# Altium project CATS-FAT.PrjPcb
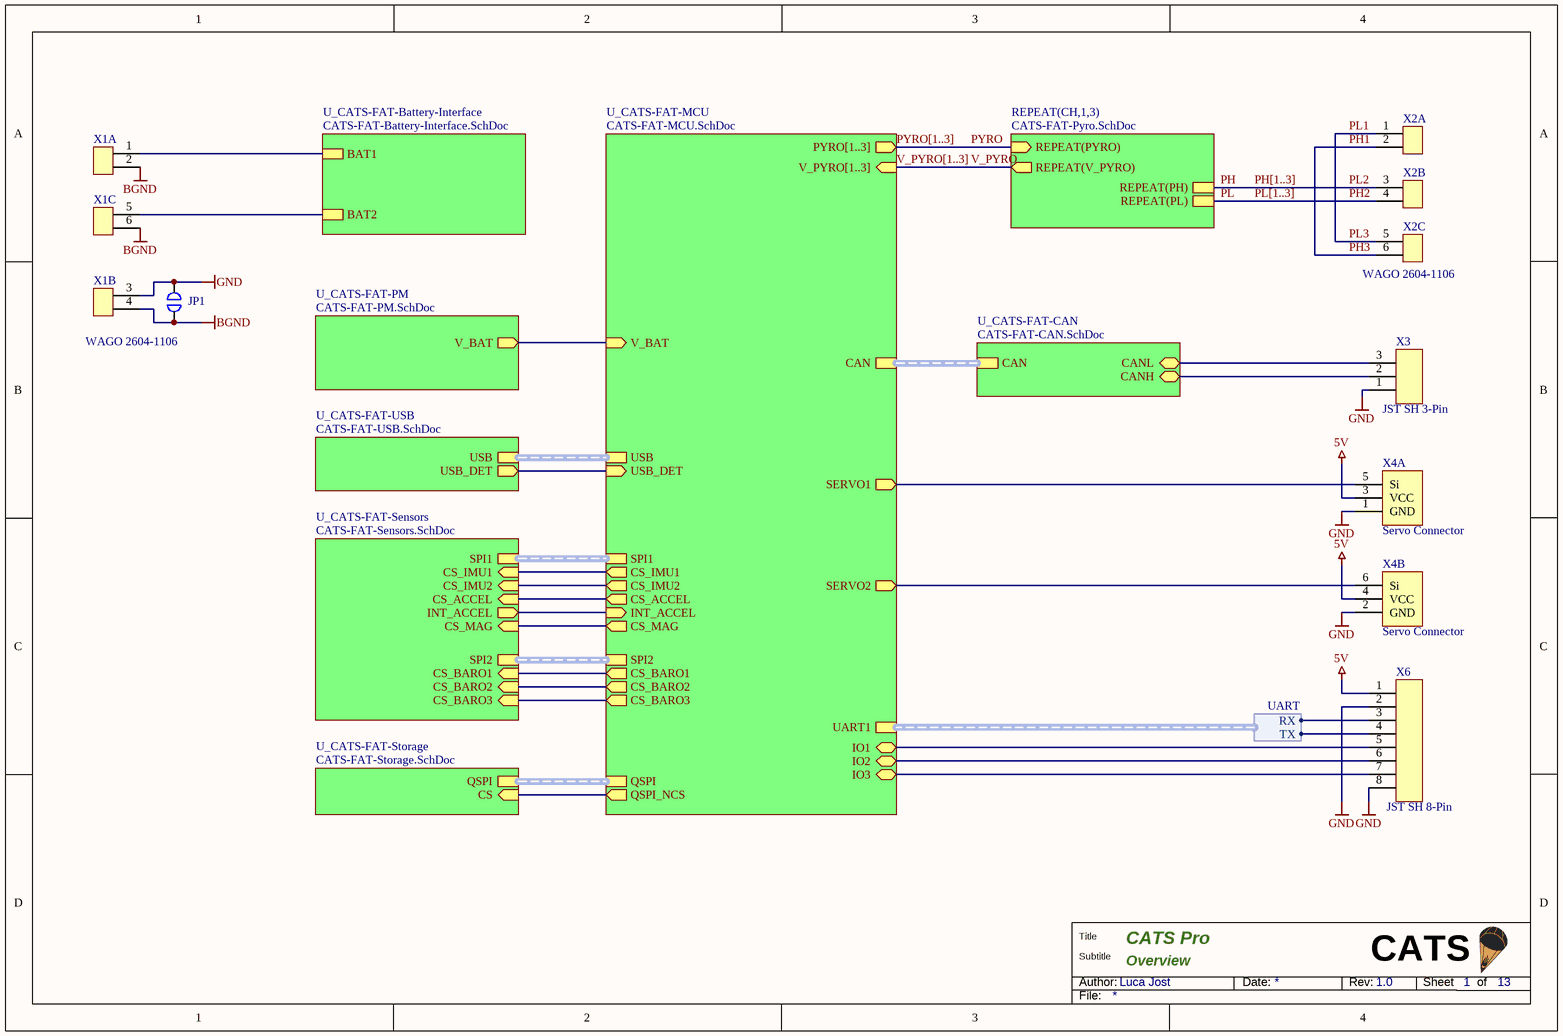
[diagram p0: CATS-FAT-Overview.SchDoc]
6 sheets, 132 parts. Net scope: hierarchical (ports join the sheet entries above them; power ports are global).
Board file: CATS-FAT..PcbDoc
Sheets:
  CATS-FAT-Overview.SchDoc
    U_CATS-FAT-Battery-Interface = CATS-FAT-Battery-Interface.SchDoc
    U_CATS-FAT-CAN = CATS-FAT-CAN.SchDoc
    U_CATS-FAT-PM = CATS-FAT-PM.SchDoc
    CH1 = CATS-FAT-Pyro.SchDoc
    CH2 = CATS-FAT-Pyro.SchDoc
    CH3 = CATS-FAT-Pyro.SchDoc
    U_CATS-FAT-MCU = CATS-FAT-MCU.SchDoc

## Sheet CATS-FAT-Overview.SchDoc: CATS Pro
size A4; Author: Luca Jost; Revision: 1.0; SheetNumber: 1; SheetTotal: 13; Subtitle: Overview

### Parts
JP1  Jumper  [SMD Solder Jumper 1x2mm]  (value not drawn)  (no BOM)
X1  WAGO 2604-1106  [THT PCB Terminal Wago 2604-1106]  (value not drawn)  (parts A,B,C of 3)
X2  WAGO 2604-1106  [THT PCB Terminal Wago 2604-1106]  (value not drawn)  (parts A,B,C of 3)
X3  JST SH 3-Pin  [SMD CONNECTOR JST-SR 3 PIN]
X4  Servo Connector  [THT Stiftleiste 6-Pol (2x3) 90°]  (parts A,B of 2)
X6  JST SH 8-Pin  [SMD CONNECTOR JST-SR 8 PIN]

### Sub-sheets
REPEAT(CH,1,3) = CATS-FAT-Pyro.SchDoc: REPEAT(PYRO) (in), REPEAT(V_PYRO) (out), REPEAT(PH), REPEAT(PL)
U_CATS-FAT-Battery-Interface = CATS-FAT-Battery-Interface.SchDoc: BAT1, BAT2
U_CATS-FAT-CAN = CATS-FAT-CAN.SchDoc: CAN (harness CAN), CANH (bidir), CANL (bidir)
U_CATS-FAT-MCU = CATS-FAT-MCU.SchDoc: SPI1 (harness SPI), SPI2 (harness SPI), CS_IMU1 (out), CS_IMU2 (out), CS_ACCEL (out), INT_ACCEL (in), CS_MAG (out), CS_BARO1 (out), CS_BARO2 (out), CS_BARO3 (out), V_PYRO[1..3] (in), PYRO[1..3] (out), USB_DET (in), QSPI (harness QSPI), QSPI_NCS (out), CAN (harness CAN), V_BAT (in), IO1 (bidir), IO2 (bidir), IO3 (bidir), UART1 (harness UART), SERVO1 (out), SERVO2 (out), USB (harness USB)
U_CATS-FAT-PM = CATS-FAT-PM.SchDoc: V_BAT (out)
U_CATS-FAT-Sensors = CATS-FAT-Sensors.SchDoc (file not in this document): CS_IMU1 (in), CS_IMU2 (in), CS_ACCEL (in), INT_ACCEL (out), CS_BARO1 (in), CS_BARO2 (in), CS_BARO3 (in), SPI1, SPI2, CS_MAG (in)
U_CATS-FAT-Storage = CATS-FAT-Storage.SchDoc (file not in this document): QSPI (harness QSPI), CS (in)
U_CATS-FAT-USB = CATS-FAT-USB.SchDoc (file not in this document): USB (harness USB), USB_DET (out)

### Harnesses
UART: TX, RX

### Nets
5V: X4.3(VCC) X4.4(VCC) X6.1
BGND: JP1.2 X1.2 X1.4 X1.6
GND: JP1.1 X1.3 X3.1 X4.1(GND) X4.2(GND) X6.2 X6.8
CS_ACCEL: sheet U_CATS-FAT-Sensors/CS_ACCEL, sheet U_CATS-FAT-MCU/CS_ACCEL
CS_BARO1: sheet U_CATS-FAT-Sensors/CS_BARO1, sheet U_CATS-FAT-MCU/CS_BARO1
CS_BARO2: sheet U_CATS-FAT-Sensors/CS_BARO2, sheet U_CATS-FAT-MCU/CS_BARO2
CS_BARO3: sheet U_CATS-FAT-Sensors/CS_BARO3, sheet U_CATS-FAT-MCU/CS_BARO3
CS_IMU1: sheet U_CATS-FAT-Sensors/CS_IMU1, sheet U_CATS-FAT-MCU/CS_IMU1
CS_IMU2: sheet U_CATS-FAT-Sensors/CS_IMU2, sheet U_CATS-FAT-MCU/CS_IMU2
CS_MAG: sheet U_CATS-FAT-Sensors/CS_MAG, sheet U_CATS-FAT-MCU/CS_MAG
INT_ACCEL: sheet U_CATS-FAT-Sensors/INT_ACCEL, sheet U_CATS-FAT-MCU/INT_ACCEL
IO1: X6.5 ; sheet U_CATS-FAT-MCU/IO1
IO2: X6.6 ; sheet U_CATS-FAT-MCU/IO2
IO3: X6.7 ; sheet U_CATS-FAT-MCU/IO3
PH: sheet REPEAT(CH,1,3)/REPEAT(PH)
PH1: X2.2
PH2: X2.4
PH3: X2.6
PL: sheet REPEAT(CH,1,3)/REPEAT(PL)
PL1: X2.1
PL2: X2.3
PL3: X2.5
PYRO: sheet REPEAT(CH,1,3)/REPEAT(PYRO)
QSPI_NCS: sheet U_CATS-FAT-Storage/CS, sheet U_CATS-FAT-MCU/QSPI_NCS
SERVO1: X4.5(Si) ; sheet U_CATS-FAT-MCU/SERVO1
SERVO2: X4.6(Si) ; sheet U_CATS-FAT-MCU/SERVO2
UART1_RX: X6.3 ; sheet U_CATS-FAT-MCU/UART1.RX
UART1_TX: X6.4 ; sheet U_CATS-FAT-MCU/UART1.TX
USB_DET: sheet U_CATS-FAT-USB/USB_DET, sheet U_CATS-FAT-MCU/USB_DET
V_BAT: sheet U_CATS-FAT-PM/V_BAT, sheet U_CATS-FAT-MCU/V_BAT
V_PYRO: sheet REPEAT(CH,1,3)/REPEAT(V_PYRO)
NetC14_2: X1.1 ; sheet U_CATS-FAT-Battery-Interface/BAT1
NetC17_2: X1.5 ; sheet U_CATS-FAT-Battery-Interface/BAT2
NetJP6_1: X3.3 ; sheet U_CATS-FAT-CAN/CANL
NetL6_3: X3.2 ; sheet U_CATS-FAT-CAN/CANH

### Buses and harness runs
bus PH[1..3]
bus PL[1..3]
bus PYRO[1..3] = sheet U_CATS-FAT-MCU/PYRO[1..3]
bus V_PYRO[1..3] = sheet U_CATS-FAT-MCU/V_PYRO[1..3]
harness sheet U_CATS-FAT-CAN/CAN = sheet U_CATS-FAT-MCU/CAN
harness sheet U_CATS-FAT-MCU/QSPI = sheet U_CATS-FAT-Storage/QSPI
harness sheet U_CATS-FAT-MCU/SPI1 = sheet U_CATS-FAT-Sensors/SPI1
harness sheet U_CATS-FAT-MCU/SPI2 = sheet U_CATS-FAT-Sensors/SPI2
harness sheet U_CATS-FAT-MCU/USB = sheet U_CATS-FAT-USB/USB

### Notes on the sheet
- Title
- Author:
- Subtitle
- Date:
- Rev:
- CATS
- Sheet
- of
- File:

### Library data of the parts
JP1 = Jumper-1: Single Position Jumper
X1 X2 = WAGO 2604-1106: PCB terminal blocks with levers and Push-in CAGE CLAMP® connection; ComponentLink1Description: Datasheet; ComponentLink1URL: https://www.wago.com/us/pcb-interconnect/pcb-terminal-block/p/2604-1106
X3 = JST SH 3-Pin: Crimp Style Connectors (Wire-to-Board type); Digikey: 455-1803-2-ND
X4 = Servo Connector Dual: 6 Pin header for PWM servos
X6 = JST SH 8-Pin: Crimp Style Connectors (Wire-to-Board type); Digikey: 455-1808-1-ND

## Sheet CATS-FAT-Battery-Interface.SchDoc: CATS Pro
size A4; Author: Luca Jost; Revision: 1.0; SheetNumber: 3; SheetTotal: 13; Subtitle: Battery OR Gate
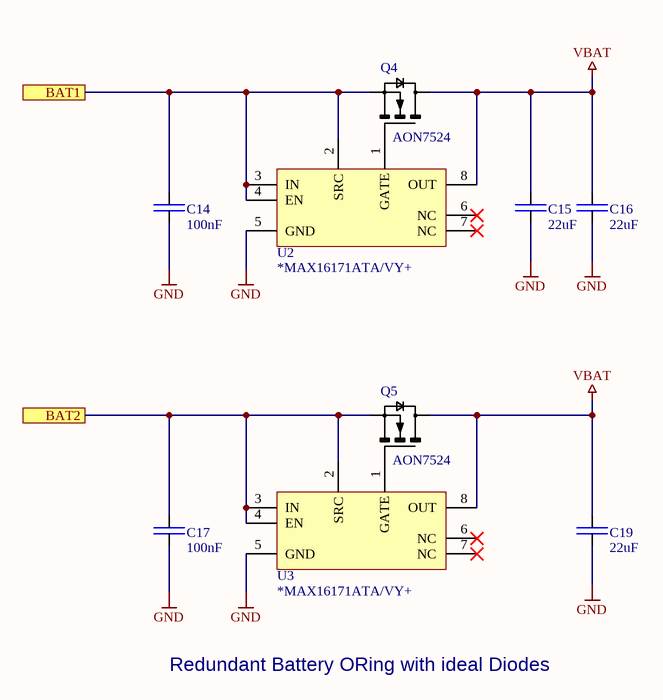
[diagram p1: CATS-FAT-Battery-Interface.SchDoc]

### Parts
C14  100nF  [SMD Keramikkondensator 0603]
C15  22uF  [SMD Keramikkondensator 0805]
C16  22uF  [SMD Keramikkondensator 0805]
C17  100nF  [SMD Keramikkondensator 0603]
C19  22uF  [SMD Keramikkondensator 0805]
Q4  AON7524  [SMD MOSFET DFN 3x3 EP]
Q5  AON7524  [SMD MOSFET DFN 3x3 EP]
U2  *MAX16171ATA/VY+  [SMD IC TDFN-8]
U3  *MAX16171ATA/VY+  [SMD IC TDFN-8]

### Ports
BAT1, BAT2

### Nets
GND: C14.1 C15.1 C16.1 C17.1 C19.1 U2.5(GND) U3.5(GND)
VBAT: C15.2 C16.2 C19.2 Q4.D Q5.D U2.8(OUT) U3.8(OUT)
NetC14_2: C14.2 Q4.S U2.2(SRC) U2.3(IN) U2.4(EN) ; port BAT1
NetC17_2: C17.2 Q5.S U3.2(SRC) U3.3(IN) U3.4(EN) ; port BAT2
NetQ4_G: Q4.G U2.1(GATE)
NetQ5_G: Q5.G U3.1(GATE)

Not connected (* = marked no-connect by the designer): U2 6(NC)* 7(NC)*; U3 6(NC)* 7(NC)*

### Notes on the sheet
- Redundant Battery ORing with ideal Diodes
- Title
- Author:
- Subtitle
- Date:
- Rev:
- CATS
- Sheet
- of
- File:

### Library data of the parts
C14 C17 = E6 - 100nF: SMD Ceramic Capacitor E6; Unit Price: 0.01; Number: -; Supplier: -
C15 C16 C19 = E6 - 22uF: SMD Ceramic Capacitor E6; Unit Price: 0.01; Number: -; Supplier: -
Q4 Q5 = AON7524: N-Channel 30V 25A (Ta), 28A (Tc) 3.1W (Ta), 32W (Tc) Surface Mount 8-DFN (3x3); Item Description: N-Channel MOSFET; Digikey: 785-1634-1-ND; ComponentLink1Description: Datasheet; ComponentLink1URL: http://aosmd.com/res/data_sheets/AON7524.pdf
U2 U3 = MAX16171ATA/VY+: OR Controller N+1 ORing Controller N-Channel 1:1 8-TDFN-CU (2x3); ComponentLink1Description: Datasheet; ComponentLink1URL: https://datasheets.maximintegrated.com/en/ds/MAX16171.pdf; Digikey: 175-MAX16171ATA/VY+-ND

## Sheet CATS-FAT-CAN.SchDoc: CATS Pro
size A4; Author: Luca Jost; Revision: 1.0; SheetNumber: 7; SheetTotal: 13; Subtitle: CAN Bus
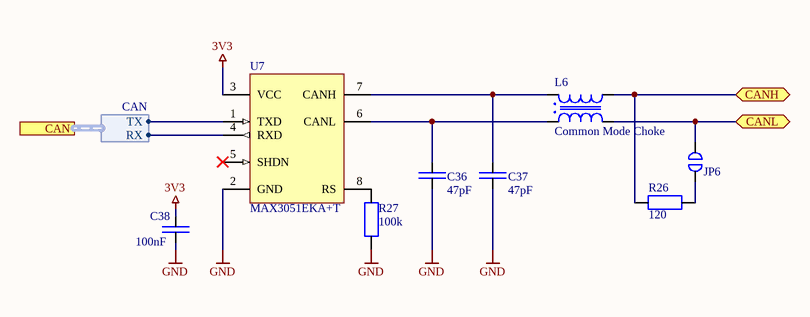
[diagram p2: CATS-FAT-CAN.SchDoc]

### Parts
C36  47pF  [SMD Keramikkondensator 0603]
C37  47pF  [SMD Keramikkondensator 0603]
C38  100nF  [SMD Keramikkondensator 0603]
JP6  Jumper  [SMD Solder Jumper 1x2mm]  (value not drawn)  (no BOM)
L6  Common Mode Choke  [SMD Common Mode Choke 2x1.2]
R26  120  [SMD Widerstand 0603]
R27  100k  [SMD Widerstand 0603]
U7  MAX3051EKA+T  [SMD IC SOT-23-8]

### Ports
CAN (harness CAN), CANH (bidir), CANL (bidir)

### Harnesses
CAN: TX, RX

### Nets
3V3: C38.2 U7.3(VCC)
GND: C36.1 C37.1 C38.1 R27.1 U7.2(GND)
CAN_RX: U7.4(RXD) ; port CAN.RX
CAN_TX: U7.1(TXD) ; port CAN.TX
NetC36_2: C36.2 L6.1 U7.6(CANL)
NetC37_2: C37.2 L6.4 U7.7(CANH)
NetJP6_1: JP6.1 L6.2 ; port CANL
NetJP6_2: JP6.2 R26.2
NetL6_3: L6.3 R26.1 ; port CANH
NetR27_2: R27.2 U7.8(RS)

Not connected (* = marked no-connect by the designer): U7 5(SHDN)*

### Notes on the sheet
- Title
- Author:
- Subtitle
- Date:
- Rev:
- CATS
- Sheet
- of
- File:

### Library data of the parts
C36 C37 = E6 - 47pF: SMD Ceramic Capacitor E6; Unit Price: 0.01; Number: -; Supplier: -
C38 = E6 - 100nF: SMD Ceramic Capacitor E6; Unit Price: 0.01; Number: -; Supplier: -
JP6 = Jumper-1: Single Position Jumper
L6 = Common Mode Choke (CAN): 2 Line Common Mode Choke Surface Mount 370mA DCR 300mOhm; ComponentLink1Description: Datasheet; ComponentLink1URL: https://www.we-online.de/katalog/datasheet/744231121.pdf; Digikey: 732-1465-2-ND
R26 = E24 - 120: SMD Chip Resistor E24; Unit Price: 0.01; Number: -; Supplier: -
R27 = E24 - 100k: SMD Chip Resistor E24; Unit Price: 0.01; Number: -; Supplier: -
U7 = MAX3051EKA+T: +3.3V, 1Mbps, Low-Supply-Current / CAN Transceiver; ComponentLink1Description: Datasheet; ComponentLink1URL: https://datasheets.maximintegrated.com/en/ds/MAX3051.pdf; Digikey: MAX3051EKA+TTR-ND

## Sheet CATS-FAT-PM.SchDoc: CATS Pro
size A4; Author: Luca Jost; Revision: 1.0; SheetNumber: 4; SheetTotal: 13; Subtitle: Power Management
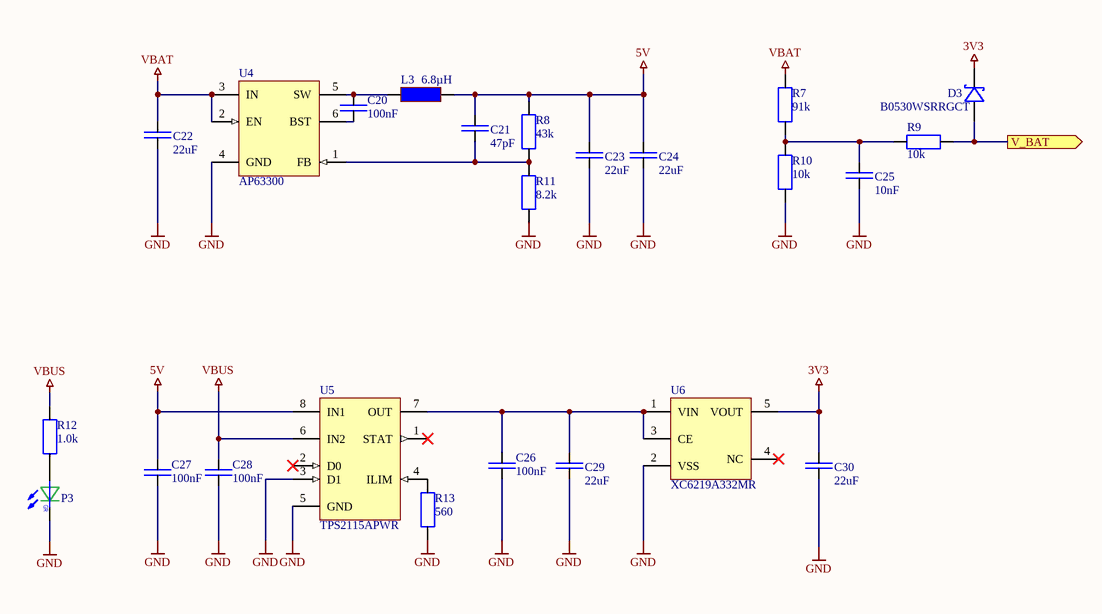
[diagram p3: CATS-FAT-PM.SchDoc]

### Parts
C20  100nF  [SMD Keramikkondensator 0603]
C21  47pF  [SMD Keramikkondensator 0603]
C22  22uF  [SMD Keramikkondensator 0805]
C23  22uF  [SMD Keramikkondensator 0805]
C24  22uF  [SMD Keramikkondensator 0805]
C25  10nF  [SMD Keramikkondensator 0603]
C26  100nF  [SMD Keramikkondensator 0603]
C27  100nF  [SMD Keramikkondensator 0603]
C28  100nF  [SMD Keramikkondensator 0603]
C29  22uF  [SMD Keramikkondensator 0805]
C30  22uF  [SMD Keramikkondensator 0805]
D3  B0530WSRRGCT  [SMD Diode SOD-323F]
L3  6.8µH  [SMD Inductor 8x8]
P3  LED  [SMD LED 0603]  (value not drawn)
R7  91k  [SMD Widerstand 0603]
R8  43k  [SMD Widerstand 0603]
R9  10k  [SMD Widerstand 0603]
R10  10k  [SMD Widerstand 0603]
R11  8.2k  [SMD Widerstand 0603]
R12  1.0k  [SMD Widerstand 0603]
R13  560  [SMD Widerstand 0603]
U4  AP63300  [SMD IC TSOT-23-6]
U5  TPS2115APWR  [SMD IC TSSOP-8]
U6  XC6219A332MR  [SMD IC SOT-23-5]

### Ports
V_BAT (out)

### Nets
3V3: C30.2 D3.K U6.5(VOUT)
5V: C21.2 C23.2 C24.2 C27.2 L3.2 R8.2 U5.8(IN1)
GND: C22.1 C23.1 C24.1 C25.1 C26.1 C27.1 C28.1 C29.1 C30.1 P3.K R10.1 R11.1 R13.1 U4.4(GND) U5.3(D1) U5.5(GND) U6.2(VSS)
VBAT: C22.2 R7.2 U4.2(EN) U4.3(IN)
VBUS: C28.2 R12.2 U5.6(IN2)
V_BAT: D3.A R9.1 ; port V_BAT
NetC20_1: C20.1 U4.6(BST)
NetC20_2: C20.2 L3.1 U4.5(SW)
NetC21_1: C21.1 R8.1 R11.2 U4.1(FB)
NetC25_2: C25.2 R7.1 R9.2 R10.2
NetC26_2: C26.2 C29.2 U5.7(OUT) U6.1(VIN) U6.3(CE)
NetP3_A: P3.A R12.1
NetR13_2: R13.2 U5.4(ILIM)

Not connected (* = marked no-connect by the designer): U5 1(STAT)* 2(D0)*; U6 4(NC)*

### Notes on the sheet
- Title
- Author:
- Subtitle
- Date:
- Rev:
- CATS
- Sheet
- of
- File:
- (in symbol LED) GR

### Library data of the parts
C20 C26-C28 = E6 - 100nF: SMD Ceramic Capacitor E6; Unit Price: 0.01; Number: -; Supplier: -
C21 = E6 - 47pF: SMD Ceramic Capacitor E6; Unit Price: 0.01; Number: -; Supplier: -
C22-C24 C29 C30 = E6 - 22uF: SMD Ceramic Capacitor E6; Unit Price: 0.01; Number: -; Supplier: -
C25 = E6 - 10nF: SMD Ceramic Capacitor E6; Unit Price: 0.01; Number: -; Supplier: -
D3 = B0530WSRRGCT: 200mW, 0.47V Schottky Barrier Diode; Digikey: B0530WSRRGCT-ND; ComponentLink1Description: Datasheet; ComponentLink1URL: https://www.taiwansemi.com/products/datasheet/B0530WS_J1709.pdf
L3 = Inductor 6.8µH / 5A: FIXED IND 6.8UH 5A 25MOHM SMD; Digikey: SRN8040TA-6R8MTR-ND
P3 = LED: Color LED
R7 = E24 - 91k: SMD Chip Resistor E24; Unit Price: 0.01; Number: -; Supplier: -
R8 = E24 - 43k: SMD Chip Resistor E24; Unit Price: 0.01; Number: -; Supplier: -
R9 R10 = E24 - 10k: SMD Chip Resistor E24; Unit Price: 0.01; Number: -; Supplier: -
R11 = E24 - 8.2k: SMD Chip Resistor E24; Unit Price: 0.01; Number: -; Supplier: -
R12 = E24 - 1.0k: SMD Chip Resistor E24; Unit Price: 0.01; Number: -; Supplier: -
R13 = E24 - 560: SMD Chip Resistor E24; Unit Price: 0.01; Number: -; Supplier: -
U4 = AP63300: 3.8V TO 32V INPUT, 3A LOW IQ SYNCHRONOUS BUCK WITH ENHANCED EMI REDUCTION; ComponentLink1Description: Datasheet; ComponentLink1URL: https://www.diodes.com/assets/Datasheets/AP63300-AP63301.pdf; Digikey: 31-AP63300WU-7TR-ND
U5 = TPS2115APWR: Autoswitching Power MUX 1.25A; Item Description: Source Selector; Digikey: 296-16940-1-ND; Value: TPS2115A; Price: 2.41; ComponentLink1Description: Datasheet; ComponentLink1URL: http://www.ti.com/lit/ds/symlink/tps2115a.pdf
U6 = XC6219A332MR: 300mA High Speed LDO Regulators with ON/OFF Switch; Digikey: 893-1167-1-ND; ComponentLink1Description: Datasheet; ComponentLink1URL: https://datasheet.lcsc.com/szlcsc/1809201520_Torex-Semicon-XC6219A332MR_C58229.pdf

## Sheet CATS-FAT-Pyro.SchDoc: CATS Pro
size A4; Author: Luca Jost; Revision: 1.0; SheetNumber: 5; SheetTotal: 13; Subtitle: High Current Channel
Used 3 times, as channels CH1, CH2, CH3. Parts and nets are listed once, with the designators drawn on the sheet.
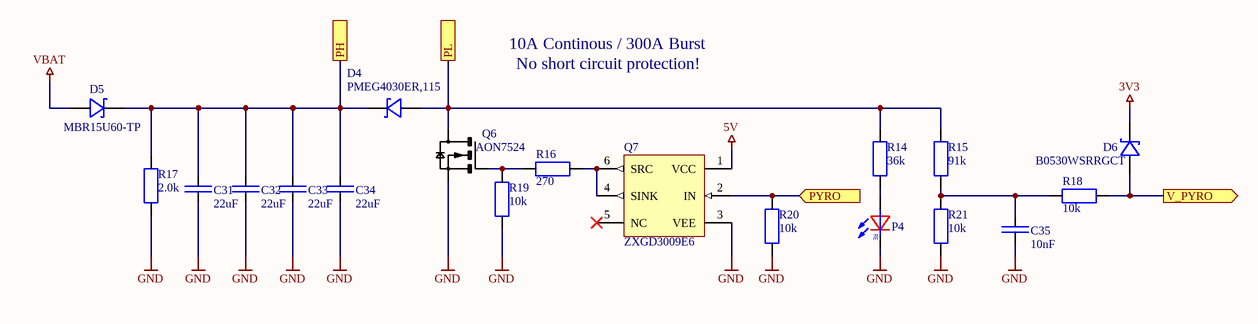
[diagram p4: CATS-FAT-Pyro.SchDoc]

### Parts
C31  22uF  [SMD Keramikkondensator 0805]
C32  22uF  [SMD Keramikkondensator 0805]
C33  22uF  [SMD Keramikkondensator 0805]
C34  22uF  [SMD Keramikkondensator 0805]
C35  10nF  [SMD Keramikkondensator 0603]
D4  PMEG4030ER,115  [SMD Diode SOD-123]
D5  MBR15U60-TP  [SMD Diode TO-277]
D6  B0530WSRRGCT  [SMD Diode SOD-323F]
P4  LED  [SMD LED 0603]  (value not drawn)
Q6  AON7524  [SMD MOSFET DFN 3x3 EP]
Q7  ZXGD3009E6  [SMD IC SOT-23-6]
R14  36k  [SMD Widerstand 0603]
R15  91k  [SMD Widerstand 0603]
R16  270  [SMD Widerstand 0603]
R17  2.0k  [SMD Widerstand 0603]
R18  10k  [SMD Widerstand 0603]
R19  10k  [SMD Widerstand 0603]
R20  10k  [SMD Widerstand 0603]
R21  10k  [SMD Widerstand 0603]

### Ports
PH, PL, PYRO (in), V_PYRO (out)

### Nets
3V3: D6.K
5V: Q7.1(VCC)
GND: C31.1 C32.1 C33.1 C34.1 C35.1 P4.K Q6.S Q7.3(VEE) R17.1 R19.1 R20.1 R21.1
VBAT: D5.A
PH: C31.2 C32.2 C33.2 C34.2 D4.K D5.K R17.2 ; port PH
PL: D4.A Q6.D R14.2 R15.2 ; port PL
PYRO: Q7.2(IN) R20.2 ; port PYRO
V_PYRO: D6.A R18.1 ; port V_PYRO
NetC35_2: C35.2 R15.1 R18.2 R21.2
NetP4_A: P4.A R14.1
NetQ6_G: Q6.G R16.1 R19.2
NetQ7_4: Q7.4(SINK) Q7.6(SRC) R16.2

Not connected (* = marked no-connect by the designer): Q7 5(NC)*

### Channels
CH1: designators end in _CH1; ports PH=PH1 PL=PL1 PYRO=PYRO1 V_PYRO=V_PYRO1
CH2: designators end in _CH2; ports PH=PH2 PL=PL2 PYRO=PYRO2 V_PYRO=V_PYRO2
CH3: designators end in _CH3; ports PH=PH3 PL=PL3 PYRO=PYRO3 V_PYRO=V_PYRO3

### Notes on the sheet
- 10A Continous / 300A Burst
- No short circuit protection!
- Title
- Author:
- Subtitle
- Date:
- Rev:
- CATS
- Sheet
- of
- File:
- (in symbol LED) RE

### Library data of the parts
C31-C34 = E6 - 22uF: SMD Ceramic Capacitor E6; Unit Price: 0.01; Number: -; Supplier: -
C35 = E6 - 10nF: SMD Ceramic Capacitor E6; Unit Price: 0.01; Number: -; Supplier: -
D4 = PMEG4030ER,115: Diode Schottky 3A Surface Mount CFP3; Digikey: 1727-5313-2-ND
D5 = MBR15U60-TP: Diode Schottky 15A Surface Mount TO-277-3; ComponentLink1Description: Datasheet; ComponentLink1URL: https://www.mccsemi.com/pdf/Products/MBR15U60(TO-277).pdf; Digikey: MBR15U60-TPMSTR-ND
D6 = B0530WSRRGCT: 200mW, 0.47V Schottky Barrier Diode; Digikey: B0530WSRRGCT-ND; ComponentLink1Description: Datasheet; ComponentLink1URL: https://www.taiwansemi.com/products/datasheet/B0530WS_J1709.pdf
P4 = LED: Color LED
Q6 = AON7524: as Q4 on sheet CATS-FAT-Battery-Interface; Digikey: 785-1634-1-ND; ComponentLink1Description: Datasheet; ComponentLink1URL: http://aosmd.com/res/data_sheets/AON7524.pdf
Q7 = ZXGD3009E6: Low-Side Gate Driver IC Non-Inverting SOT-26; Digikey: ZXGD3009E6TADICT-ND; ComponentLink1Description: Datasheet; ComponentLink1URL: https://www.diodes.com/assets/Datasheets/ZXGD3009E6.pdf
R14 = E24 - 36k: SMD Chip Resistor E24; Unit Price: 0.01; Number: -; Supplier: -
R15 = E24 - 91k: SMD Chip Resistor E24; Unit Price: 0.01; Number: -; Supplier: -
R16 = E24 - 270: SMD Chip Resistor E24; Unit Price: 0.01; Number: -; Supplier: -
R17 = E24 - 2.0k: SMD Chip Resistor E24; Unit Price: 0.01; Number: -; Supplier: -
R18-R21 = E24 - 10k: SMD Chip Resistor E24; Unit Price: 0.01; Number: -; Supplier: -

## Sheet CATS-FAT-MCU.SchDoc: CATS Pro
size A4; Author: Luca Jost; Revision: 1.0; SheetNumber: 2; SheetTotal: 13; Subtitle: MCU
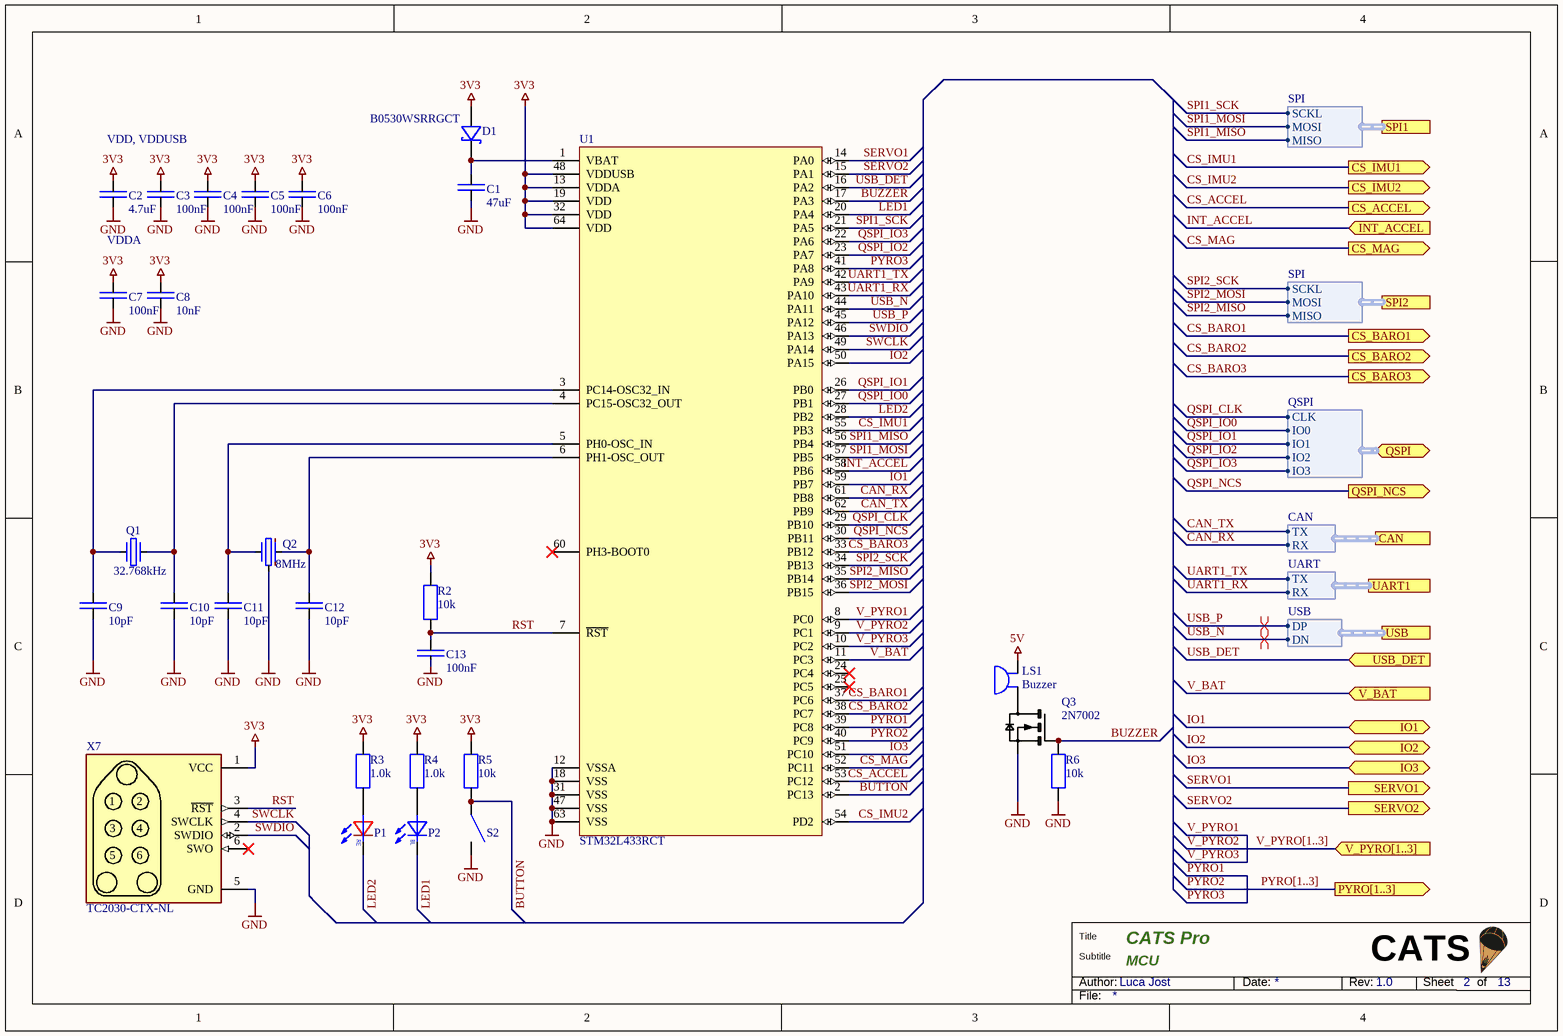
[diagram p5: CATS-FAT-MCU.SchDoc]

### Parts
C1  47uF  [SMD Keramikkondensator 0805]
C2  4.7uF  [SMD Keramikkondensator 0603]
C3  100nF  [SMD Keramikkondensator 0603]
C4  100nF  [SMD Keramikkondensator 0603]
C5  100nF  [SMD Keramikkondensator 0603]
C6  100nF  [SMD Keramikkondensator 0603]
C7  100nF  [SMD Keramikkondensator 0603]
C8  10nF  [SMD Keramikkondensator 0603]
C9  10pF  [SMD Keramikkondensator 0603]
C10  10pF  [SMD Keramikkondensator 0603]
C11  10pF  [SMD Keramikkondensator 0603]
C12  10pF  [SMD Keramikkondensator 0603]
C13  100nF  [SMD Keramikkondensator 0603]
D1  B0530WSRRGCT  [SMD Diode SOD-323F]
LS1  Buzzer  [SMD BUZZER CMT-8504]
P1  LED  [SMD LED 0603]  (value not drawn)
P2  LED  [SMD LED 0603]  (value not drawn)
Q1  32.768kHz  [SMD Crystal 3.2x1.5x0.9]
Q2  8MHz  [SMD Crystal 3.2X2.5X0.8]
Q3  2N7002  [SMD MOSFET SOT-23]
R2  10k  [SMD Widerstand 0603]
R3  1.0k  [SMD Widerstand 0603]
R4  1.0k  [SMD Widerstand 0603]
R5  10k  [SMD Widerstand 0603]
R6  10k  [SMD Widerstand 0603]
S2  SMD-Button  [SMD Button 2.5x3x1.2]  (value not drawn)
U1  STM32L433RCT  [SMD IC LQFP64-N]
X7  TC2030-CTX-NL  [SMD Connector TC2030 w/ holes]  (no BOM)

### Ports
CAN (harness CAN), CS_ACCEL (out), CS_BARO1 (out), CS_BARO2 (out), CS_BARO3 (out), CS_IMU1 (out), CS_IMU2 (out), CS_MAG (out), INT_ACCEL (in), IO1 (bidir), IO2 (bidir), IO3 (bidir), PYRO[1..3] (out), QSPI (bidir, harness QSPI), QSPI_NCS (out), SERVO1 (out), SERVO2 (out), SPI1 (harness SPI), SPI2 (harness SPI), UART1 (harness UART), USB (harness USB), USB_DET (in), V_BAT (in), V_PYRO[1..3] (in)

### Harnesses
SPI: SCKL, MOSI, MISO
QSPI: CLK, IO0, IO1, IO2, IO3
CAN: TX, RX
UART: TX, RX
USB: DP, DN

### Nets
3V3: C2.2 C3.2 C4.2 C5.2 C6.2 C7.2 C8.2 D1.A R2.2 R3.2 R4.2 R5.2 U1.13(VDDA) U1.19(VDD) U1.32(VDD) U1.48(VDDUSB) U1.64(VDD) X7.1(VCC)
5V: LS1.1
GND: C1.1 C2.1 C3.1 C4.1 C5.1 C6.1 C7.1 C8.1 C9.1 C10.1 C11.1 C12.1 C13.1 Q2.3 Q3.S R6.1 S2.2 U1.12(VSSA) U1.18(VSS) U1.31(VSS) U1.47(VSS) U1.63(VSS) X7.5(GND)
BUTTON: R5.1 S2.1 U1.2(PC13)
BUZZER: Q3.G R6.2 U1.17(PA3)
CAN_RX: U1.61(PB8) ; port CAN.RX
CAN_TX: U1.62(PB9) ; port CAN.TX
CS_ACCEL: U1.53(PC12) ; port CS_ACCEL
CS_BARO1: U1.37(PC6) ; port CS_BARO1
CS_BARO2: U1.38(PC7) ; port CS_BARO2
CS_BARO3: U1.33(PB12) ; port CS_BARO3
CS_IMU1: U1.55(PB3) ; port CS_IMU1
CS_IMU2: U1.54(PD2) ; port CS_IMU2
CS_MAG: U1.52(PC11) ; port CS_MAG
INT_ACCEL: U1.58(PB6) ; port INT_ACCEL
IO1: U1.59(PB7) ; port IO1
IO2: U1.50(PA15) ; port IO2
IO3: U1.51(PC10) ; port IO3
LED1: P2.K U1.20(PA4)
LED2: P1.K U1.28(PB2)
PYRO1: U1.39(PC8)
PYRO2: U1.40(PC9)
PYRO3: U1.41(PA8)
QSPI_CLK: U1.29(PB10) ; port QSPI.CLK
QSPI_IO0: U1.27(PB1) ; port QSPI.IO0
QSPI_IO1: U1.26(PB0) ; port QSPI.IO1
QSPI_IO2: U1.23(PA7) ; port QSPI.IO2
QSPI_IO3: U1.22(PA6) ; port QSPI.IO3
QSPI_NCS: U1.30(PB11) ; port QSPI_NCS
RST: C13.2 R2.1 U1.7(~{RST}) X7.3(~{RST})
SERVO1: U1.14(PA0) ; port SERVO1
SERVO2: U1.15(PA1) ; port SERVO2
SPI1_MISO: U1.56(PB4) ; port SPI1.MISO
SPI1_MOSI: U1.57(PB5) ; port SPI1.MOSI
SPI1_SCK: U1.21(PA5) ; port SPI1.SCKL
SPI2_MISO: U1.35(PB14) ; port SPI2.MISO
SPI2_MOSI: U1.36(PB15) ; port SPI2.MOSI
SPI2_SCK: U1.34(PB13) ; port SPI2.SCKL
SWCLK: U1.49(PA14) X7.4(SWCLK)
SWDIO: U1.46(PA13) X7.2(SWDIO)
UART1_RX: U1.43(PA10) ; port UART1.RX
UART1_TX: U1.42(PA9) ; port UART1.TX
USB_DET: U1.16(PA2) ; port USB_DET
USB_N: U1.44(PA11) ; port USB.DN
USB_P: U1.45(PA12) ; port USB.DP
V_BAT: U1.11(PC3) ; port V_BAT
V_PYRO1: U1.8(PC0)
V_PYRO2: U1.9(PC1)
V_PYRO3: U1.10(PC2)
NetC1_2: C1.2 D1.K U1.1(VBAT)
NetC9_2: C9.2 Q1.1 U1.3(PC14-OSC32_IN)
NetC10_2: C10.2 Q1.2 U1.4(PC15-OSC32_OUT)
NetC11_2: C11.2 Q2.1 U1.5(PH0-OSC_IN)
NetC12_2: C12.2 Q2.2 U1.6(PH1-OSC_OUT)
NetLS1_2: LS1.2 Q3.D
NetP1_A: P1.A R3.1
NetP2_A: P2.A R4.1

Not connected (* = marked no-connect by the designer): U1 24(PC4)* 25(PC5)* 60(PH3-BOOT0)*; X7 6(SWO)*

### Buses and harness runs
bus PYRO[1..3] = port PYRO[1..3]
bus V_PYRO[1..3] = port V_PYRO[1..3]

### Layout directives
differential pair: USB_N, USB_P

### Notes on the sheet
- VDD, VDDUSB
- VDDA
- Title
- Author:
- Subtitle
- Date:
- Rev:
- CATS
- Sheet
- of
- File:
- (in symbol LED) BL; RE

### Library data of the parts
C1 = E6 - 47uF: SMD Ceramic Capacitor E6; Unit Price: 0.01; Number: -; Supplier: -
C2 = E6 - 4.7uF: SMD Ceramic Capacitor E6; Unit Price: 0.01; Number: -; Supplier: -
C3-C7 C13 = E6 - 100nF: SMD Ceramic Capacitor E6; Unit Price: 0.01; Number: -; Supplier: -
C8 = E6 - 10nF: SMD Ceramic Capacitor E6; Unit Price: 0.01; Number: -; Supplier: -
C9-C12 = E6 - 10pF: SMD Ceramic Capacitor E6; Unit Price: 0.01; Number: -; Supplier: -
D1 = B0530WSRRGCT: 200mW, 0.47V Schottky Barrier Diode; Digikey: B0530WSRRGCT-ND; ComponentLink1Description: Datasheet; ComponentLink1URL: https://www.taiwansemi.com/products/datasheet/B0530WS_J1709.pdf
LS1 = Buzzer: Buzzers Indicator, Internally Driven Piezo 12V 10mA 3kHz 100dB @ 12V, 10cm Through Hole PC Pins; Digikey: 2104-IP303012-1-ND; ComponentLink1Description: Datasheet; ComponentLink1URL: https://dbunlimitedco.com/images/product_images/2D-Drawings/IP303012-1.pdf
P1 P2 = LED: Color LED
Q1 = Crystal 32.768kHz: CRYSTAL 32.7680KHZ 9PF SMD; Digikey: 2195-CM7VT1ALOWESR32.768KHZ9PF20TAQCTR-ND
Q2 = Crystal: SMD Crystal Resonators 8MHz ±10ppm SMD,3.2x2.5mm; Digikey: 535-15255-1-ND
Q3 = 2N7002: MOSFET N-Channel 20V / 115mA; Item Description: N-Channel MOSFET; Digikey: 2N7002NCT-ND; Price: 0.32; ComponentLink1Description: Datasheet; ComponentLink1URL: https://www.onsemi.com/pub/Collateral/NDS7002A-D.PDF
R2 R5 R6 = E24 - 10k: SMD Chip Resistor E24; Unit Price: 0.01; Number: -; Supplier: -
R3 R4 = E24 - 1.0k: SMD Chip Resistor E24; Unit Price: 0.01; Number: -; Supplier: -
S2 = Button 3mmx2.5mm: Button SPST; LCSC: C128937; Digikey: SW1020TR-ND
U1 = STM32L433RCT: ARM® Cortex®-M4 series Microcontroller IC 32-Bit 80MHz 256KB (256K x 8) FLASH 64-LQFP (10x10); Digikey: 497-17968-ND; ComponentLink1Description: Datasheet; ComponentLink1URL: https://www.st.com/content/ccc/resource/technical/document/datasheet/f7/a0/fc/27/24/4e/4f/3f/DM00257192.pdf/files/DM00257192.pdf/jcr:content/translations/en.DM00257192.pdf
X7 = TC2030-CTX-NL: Tag-Connect for ARM-Cortex (6-Pin)

## Nets that join several sheets
3V3: CATS-FAT-CAN (C38.2 U7.3), CATS-FAT-PM (C30.2 D3.K U6.5), CH1 (D6_CH1.K), CH2 (D6_CH2.K), CH3 (D6_CH3.K), CATS-FAT-MCU (18 pins)
5V: CATS-FAT-Overview (X4.3 X4.4 X6.1), CATS-FAT-PM (7 pins), CH1 (Q7_CH1.1), CH2 (Q7_CH2.1), CH3 (Q7_CH3.1), CATS-FAT-MCU (LS1.1)
GND: CATS-FAT-Overview (7 pins), CATS-FAT-Battery-Interface (7 pins), CATS-FAT-CAN (5 pins), CATS-FAT-PM (17 pins), CH1 (12 pins), CH2 (12 pins), CH3 (12 pins), CATS-FAT-MCU (23 pins)
VBAT: CATS-FAT-Battery-Interface (7 pins), CATS-FAT-PM (C22.2 R7.2 U4.2 U4.3), CH1 (D5_CH1.A), CH2 (D5_CH2.A), CH3 (D5_CH3.A)
CAN_RX: CATS-FAT-CAN (U7.4), CATS-FAT-MCU (U1.61)
CAN_TX: CATS-FAT-CAN (U7.1), CATS-FAT-MCU (U1.62)
IO1: CATS-FAT-Overview (X6.5), CATS-FAT-MCU (U1.59)
IO2: CATS-FAT-Overview (X6.6), CATS-FAT-MCU (U1.50)
IO3: CATS-FAT-Overview (X6.7), CATS-FAT-MCU (U1.51)
NetC14_2: CATS-FAT-Overview (X1.1), CATS-FAT-Battery-Interface (5 pins)
NetC17_2: CATS-FAT-Overview (X1.5), CATS-FAT-Battery-Interface (5 pins)
NetJP6_1: CATS-FAT-Overview (X3.3), CATS-FAT-CAN (JP6.1 L6.2)
NetL6_3: CATS-FAT-Overview (X3.2), CATS-FAT-CAN (L6.3 R26.1)
PH1: CATS-FAT-Overview (X2.2), CH1 (7 pins)
PH2: CATS-FAT-Overview (X2.4), CH2 (7 pins)
PH3: CATS-FAT-Overview (X2.6), CH3 (7 pins)
PL1: CATS-FAT-Overview (X2.1), CH1 (D4_CH1.A Q6_CH1.D R14_CH1.2 R15_CH1.2)
PL2: CATS-FAT-Overview (X2.3), CH2 (D4_CH2.A Q6_CH2.D R14_CH2.2 R15_CH2.2)
PL3: CATS-FAT-Overview (X2.5), CH3 (D4_CH3.A Q6_CH3.D R14_CH3.2 R15_CH3.2)
PYRO1: CH1 (Q7_CH1.2 R20_CH1.2), CATS-FAT-MCU (U1.39)
PYRO2: CH2 (Q7_CH2.2 R20_CH2.2), CATS-FAT-MCU (U1.40)
PYRO3: CH3 (Q7_CH3.2 R20_CH3.2), CATS-FAT-MCU (U1.41)
SERVO1: CATS-FAT-Overview (X4.5), CATS-FAT-MCU (U1.14)
SERVO2: CATS-FAT-Overview (X4.6), CATS-FAT-MCU (U1.15)
UART1_RX: CATS-FAT-Overview (X6.3), CATS-FAT-MCU (U1.43)
UART1_TX: CATS-FAT-Overview (X6.4), CATS-FAT-MCU (U1.42)
V_BAT: CATS-FAT-PM (D3.A R9.1), CATS-FAT-MCU (U1.11)
V_PYRO1: CH1 (D6_CH1.A R18_CH1.1), CATS-FAT-MCU (U1.8)
V_PYRO2: CH2 (D6_CH2.A R18_CH2.1), CATS-FAT-MCU (U1.9)
V_PYRO3: CH3 (D6_CH3.A R18_CH3.1), CATS-FAT-MCU (U1.10)